# EAGLE design mic-input (EAGLE 8.0.2)
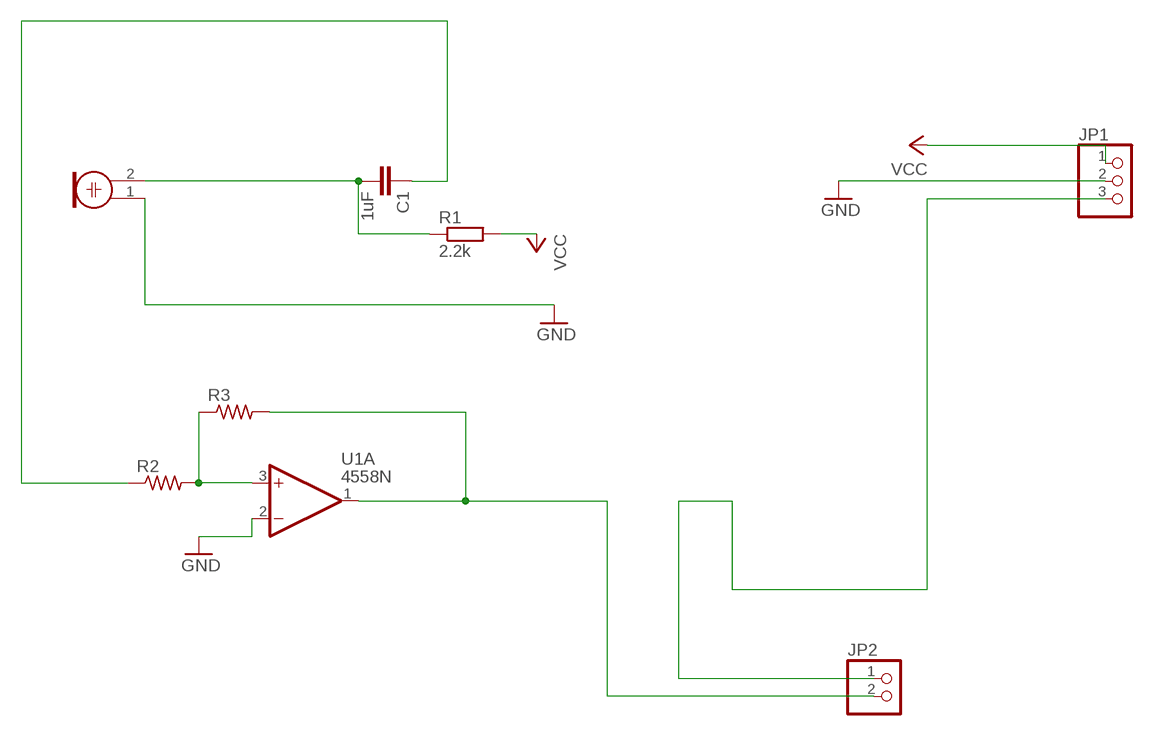
[diagram p0: schematic, sheet 1]

## Parts
C1  1uF  C2,5-3  [C2.5-3]
JP1  PINHD-1X3  [1X03]
JP2  PINHD-1X2  [1X02]
M1  ELECTRET_MICROPHON-F6050AP  [F6050AP]
R1  2.2k  R-EU_0204/7  [0204/7]
R2  R-US_0204/7  [0204/7]
R3  R-US_0204/7  [0204/7]
U1  4558N  [DIL08]

## Nets
GND: JP1.2 M1.1 U1.2(A:-IN)
N$1: C1.2 M1.2 R1.1
N$2: C1.1 R2.1
N$3: R2.2 R3.1 U1.3(A:+IN)
N$4: JP2.2 R3.2 U1.1(A:OUT)
N$5: JP1.3 JP2.1
VCC: JP1.1 R1.2
Unconnected: U1.5(B:+IN) U1.6(B:-IN) U1.7(B:OUT)

## Power pins joined to a net without a drawn wire
VCC+: U1.8(P:VCC+)
VCC-: U1.4(P:VCC-)

## Library data of the parts
C1 = capacitor-wima:C: CAPACITOR naming: grid - package width
JP1 = pinhead:PINHD-1X3: PIN HEADER
JP2 = pinhead:PINHD-1X2: PIN HEADER
M1 = microphon:ELECTRET_MICROPHON-: Electret Condenser Microphone
R1 = resistor:R-EU_: RESISTOR, European symbol
R2 R3 = adafruit:R-US_: RESISTOR, American symbol
U1 = op-amp:4558: OP-AMP - Dual

## Board
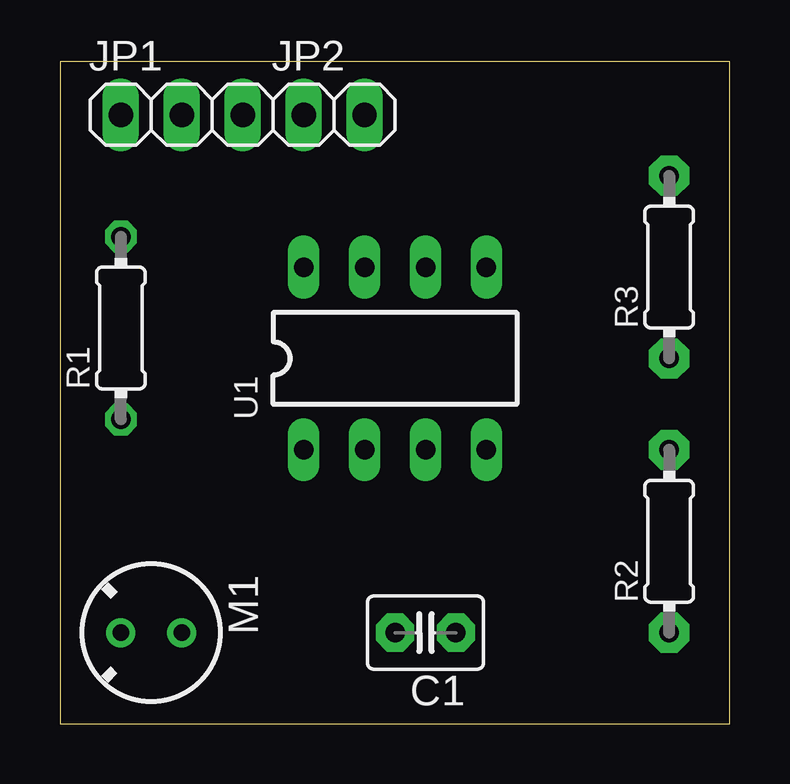
[diagram p1: board, top side]
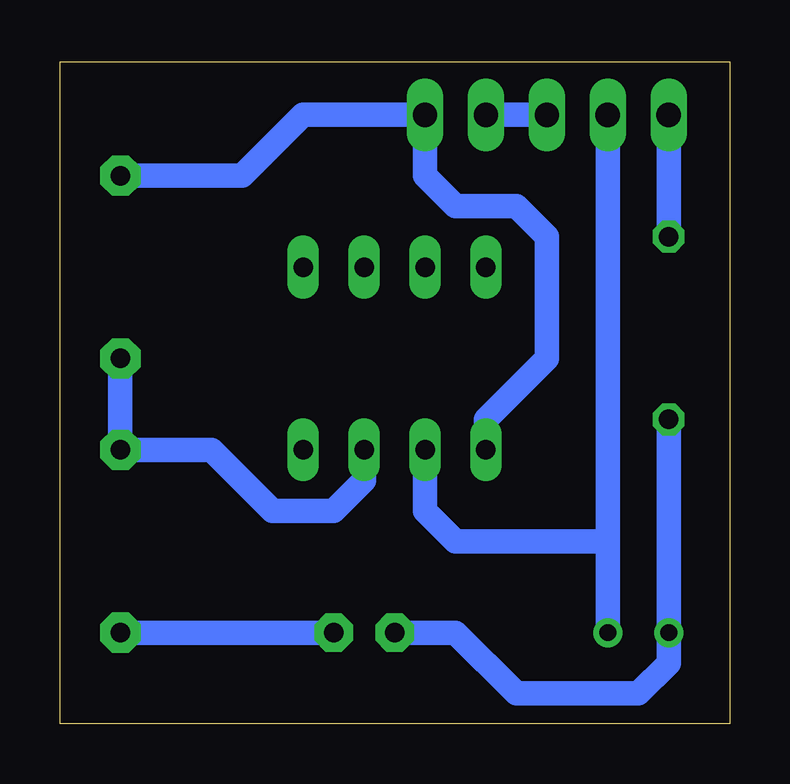
[diagram p2: board, bottom side, seen from below]

Size 27.92 x 27.61 mm. Coordinates in mm from the lower left corner, seen from the top.
Outline: 0,0 27.92,0 27.92,27.61 0,27.61 0,0
Copper layers (1*16): Top 0.035mm / dielectric 1.5mm / Bottom 0.035mm
Design rules "default": minimum track width 10mil, minimum drill 24mil, track to track 8mil, track to pad 8mil, pad to pad 8mil, via to via 8mil, smd to smd 8mil, copper to edge 40mil, drill to drill 8mil, minimum pad ring 10mil, minimum via ring 8mil, stop-mask expansion 4mil, vias tented up to drill 0mil, thermal gap 10mil

### Footprints (pad centres in the part's own frame; a part is rotated, then mirrored left to right if it is on the bottom)
C2.5-3 = drill 0.813 pad 1.6 octagon: 1 -1.27,0; 2 1.27,0
1X03 = drill 1.016 long: 1 -2.54,0; 2 0,0; 3 2.54,0
1X02 = drill 1.016 long: 1 -1.27,0; 2 1.27,0
F6050AP = drill 0.7 pad 1.2: 1 0,1.27; 2 0,-1.27
0204/7 = drill 0.813 octagon: 1 -3.81,0; 2 3.81,0
0204/7' = drill 0.813 pad 1.676 octagon: 1 -3.81,0; 2 3.81,0
DIL08 = drill 0.813 long: 1 -3.81,-3.81; 2 -1.27,-3.81; 3 1.27,-3.81; 4 3.81,-3.81; 5 3.81,3.81; 6 1.27,3.81; 7 -1.27,3.81; 8 -3.81,3.81

### Placement (x,y rotation side)
C1  15.24,3.81 180 top
JP1  5.08,25.4 0 top
JP2  11.43,25.4 0 top
M1  3.81,3.81 270 top
R1  2.54,16.51 90 top
R2  [0204/7']  25.4,7.62 90 top
R3  [0204/7']  25.4,19.05 90 top
U1  13.97,15.24 0 top

### Tracks (layer width: path | path; a pad name or v marks a point on that pad's centre or on a via)
GND
  Bottom 1.016: 5.08,7.62 JP1.2 | 5.08,7.62 M1.1 | U1.2 12.7,8.89 11.43,7.62 5.08,7.62
N$1
  Bottom 1.016: C1.2 11.43,3.81 8.89,1.27 3.81,1.27 2.54,2.54 M1.2 R1.1
N$2
  Bottom 1.016: R2.1 C1.1
N$3
  Bottom 1.016: U1.3 15.24,10.16 16.51,8.89 19.05,8.89 21.59,11.43 R2.2 R3.1
N$4
  Bottom 1.016: R3.2 20.32,22.86 17.78,25.4 JP2.2 12.7,22.86 11.43,21.59 8.89,21.59 7.62,20.32 7.62,15.24 10.16,12.7 U1.1
N$5
  Bottom 1.016: JP2.1 JP1.3
VCC
  Bottom 1.016: R1.2 JP1.1